# EAGLE design laser_shield (EAGLE 8.0.0)
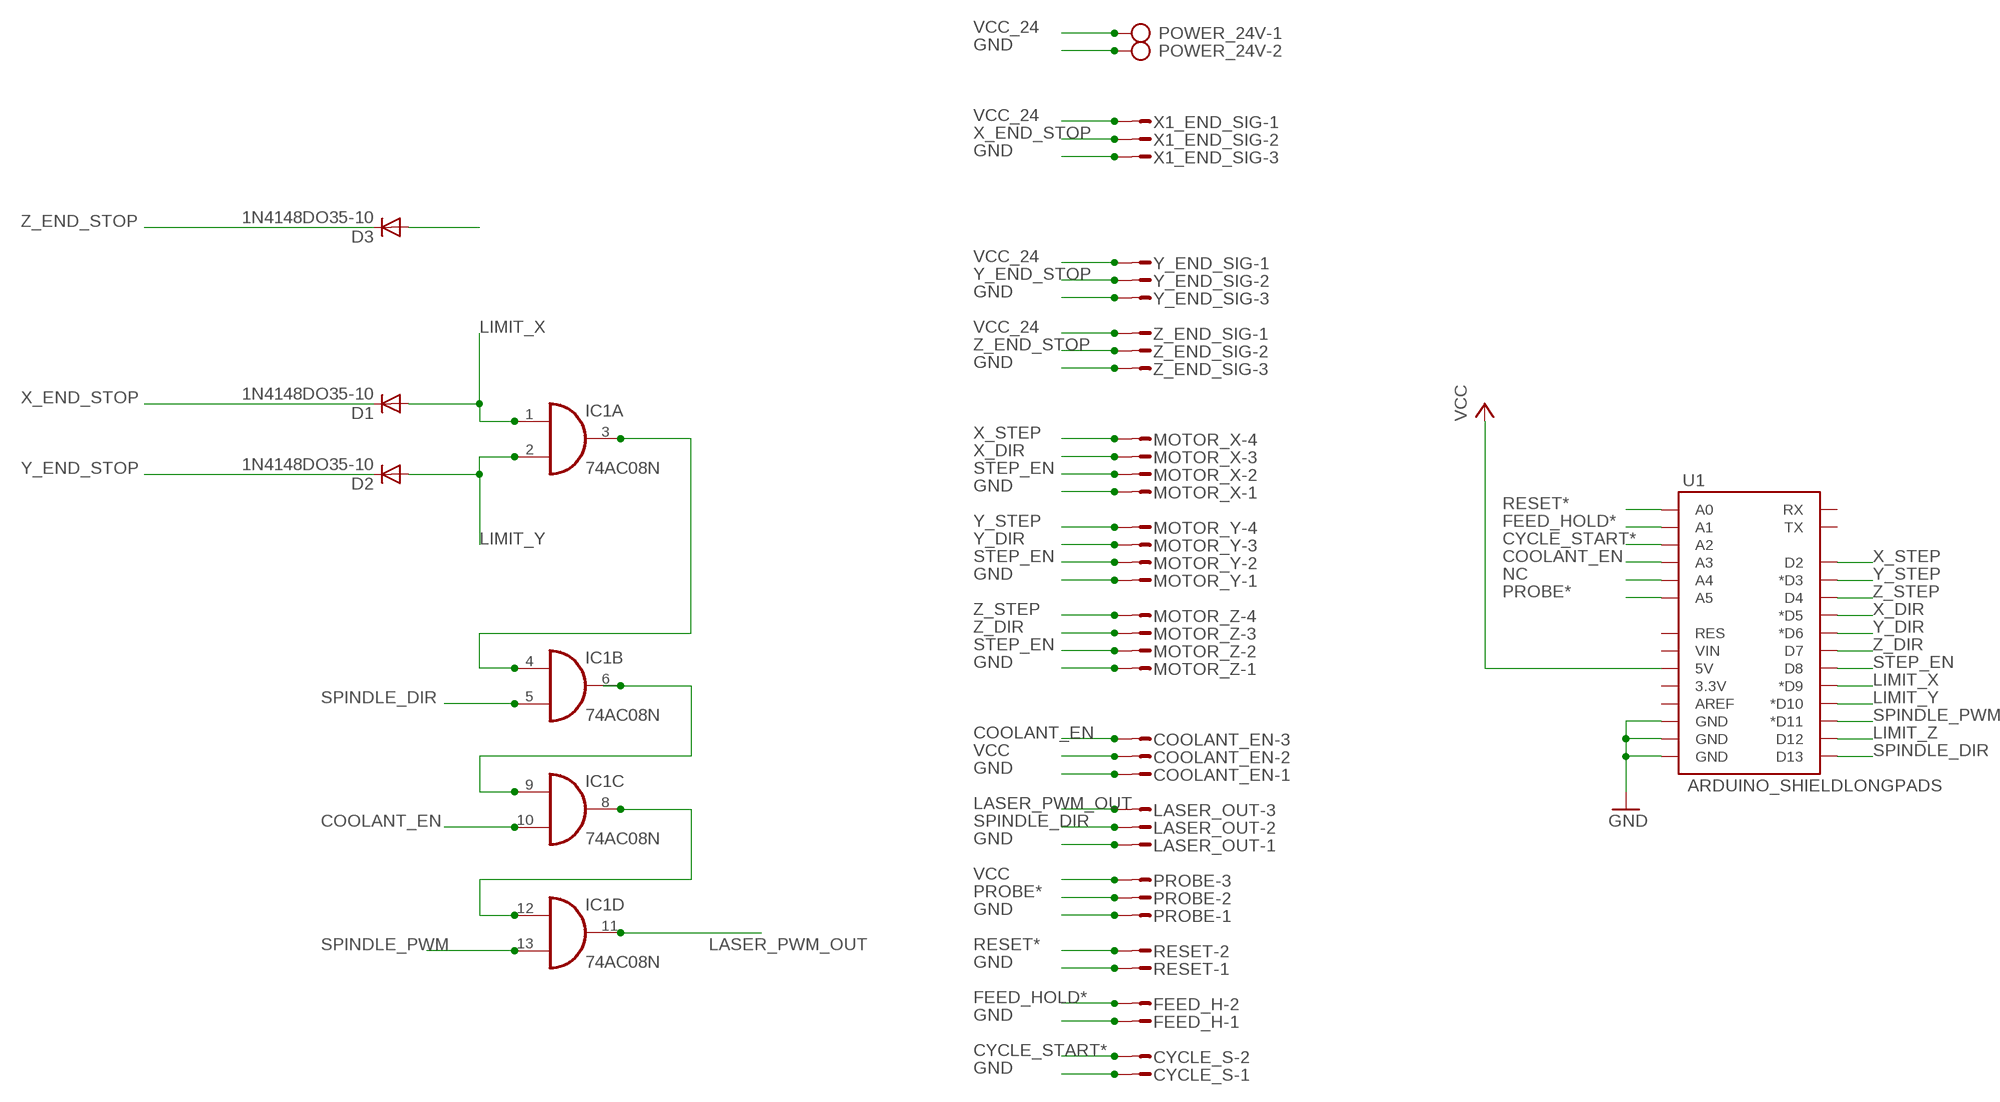
[diagram p0: schematic, sheet 1]

## Parts
COOLANT_EN  L03P  [L03P]
CYCLE_S  L02P  [L02P]
D1  1N4148DO35-10  [DO35-10]
D2  1N4148DO35-10  [DO35-10]
D3  1N4148DO35-10  [DO35-10]
FEED_H  L02P  [L02P]
IC1  74AC08N  [DIL14]
LASER_OUT  L03P  [L03P]
MOTOR_X  L04P  [L04P]
MOTOR_Y  L04P  [L04P]
MOTOR_Z  L04P  [L04P]
POWER_24V  AK300/2  [AK300/2]
PROBE  L03P  [L03P]
RESET  L02P  [L02P]
U1  ARDUINO_SHIELDLONGPADS  [DUEMILANOVE_SHIELD_LONGPADS]
X1_END_SIG  L03P  [L03P]
Y_END_SIG  L03P  [L03P]
Z_END_SIG  L03P  [L03P]

## Nets
COOLANT_EN: COOLANT_EN.3 IC1.10(C:I1) U1.A3
CYCLE_START*: CYCLE_S.2 U1.A2
FEED_HOLD*: FEED_H.2 U1.A1
GND [VCC_24]: COOLANT_EN.1 CYCLE_S.1 FEED_H.1 LASER_OUT.1 MOTOR_X.1 MOTOR_Y.1 MOTOR_Z.1 POWER_24V.2 PROBE.1 RESET.1 U1.GND@0(GND) U1.GND@1(GND) U1.GND@2(GND) X1_END_SIG.3 Y_END_SIG.3 Z_END_SIG.3
LASER_PWM_OUT: IC1.11(D:O) LASER_OUT.3
LIMIT_X: D1.A IC1.1(A:I0) U1.D9(*D9)
LIMIT_Y: D2.A IC1.2(A:I1) U1.D10(*D10)
LIMIT_Z: D3.A U1.D12
N$3: IC1.3(A:O) IC1.4(B:I0)
N$4: IC1.6(B:O) IC1.9(C:I0)
N$5: IC1.8(C:O) IC1.12(D:I0)
NC: U1.A4
PROBE*: PROBE.2 U1.A5
RESET*: RESET.2 U1.A0
SPINDLE_DIR: IC1.5(B:I1) LASER_OUT.2 U1.D13
SPINDLE_PWM: IC1.13(D:I1) U1.D11(*D11)
STEP_EN: MOTOR_X.2 MOTOR_Y.2 MOTOR_Z.2 U1.D8
VCC: COOLANT_EN.2 PROBE.3 U1.5V
VCC_24 [VCC_24]: POWER_24V.1 X1_END_SIG.1 Y_END_SIG.1 Z_END_SIG.1
X_DIR: MOTOR_X.3 U1.D5(*D5)
X_END_STOP: D1.C X1_END_SIG.2
X_STEP: MOTOR_X.4 U1.D2
Y_DIR: MOTOR_Y.3 U1.D6(*D6)
Y_END_STOP: D2.C Y_END_SIG.2
Y_STEP: MOTOR_Y.4 U1.D3(*D3)
Z_DIR: MOTOR_Z.3 U1.D7
Z_END_STOP: D3.C Z_END_SIG.2
Z_STEP: MOTOR_Z.4 U1.D4
Unconnected: U1.3.3V U1.AREF U1.RES U1.RX U1.TX U1.VIN

## Power pins joined to a net without a drawn wire
GND: IC1.7(P:GND)
VCC: IC1.14(P:VCC)

## Library data of the parts
COOLANT_EN LASER_OUT PROBE X1_END_SIG Y_END_SIG Z_END_SIG = con-amp-mt:L03P: AMP MT CONNECTOR; OC_FARNELL: unknown; OC_NEWARK: unknown
CYCLE_S FEED_H RESET = con-amp-mt:L02P: AMP MT CONNECTOR; OC_FARNELL: unknown; OC_NEWARK: unknown
D1-D3 = diode:1N4148: DIODE high speed (Philips)
IC1 = 74xx-eu:74*08: Quad 2-input AND gate
MOTOR_X MOTOR_Y MOTOR_Z = con-amp-mt:L04P: AMP MT CONNECTOR; OC_FARNELL: unknown; OC_NEWARK: unknown
POWER_24V = con-ptr500:AK300/2: CONNECTOR; OC_FARNELL: unknown; OC_NEWARK: unknown
U1 = SparkFun-Boards:ARDUINO_SHIELD: Arduino shield footprint

## Net classes
0 default: width 0.025 mm, drill 0.8 mm, clearance 0.025 mm
2 VCC_24: width 1 mm, drill 0.8 mm, clearance 0.025 mm

## Board
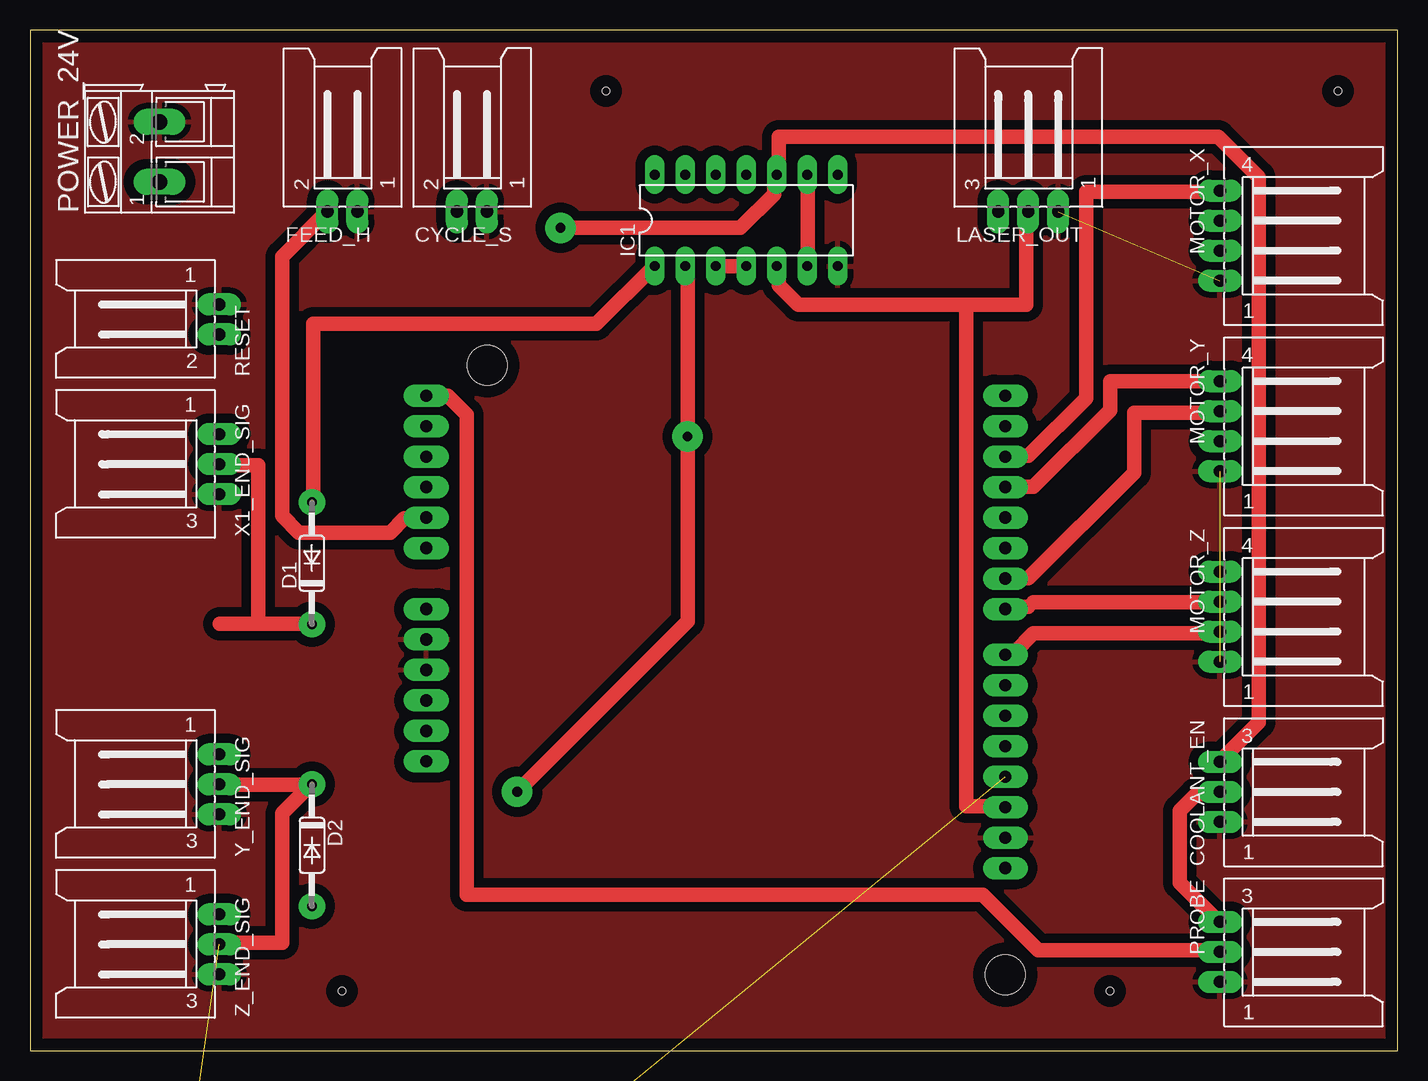
[diagram p1: board, top side]
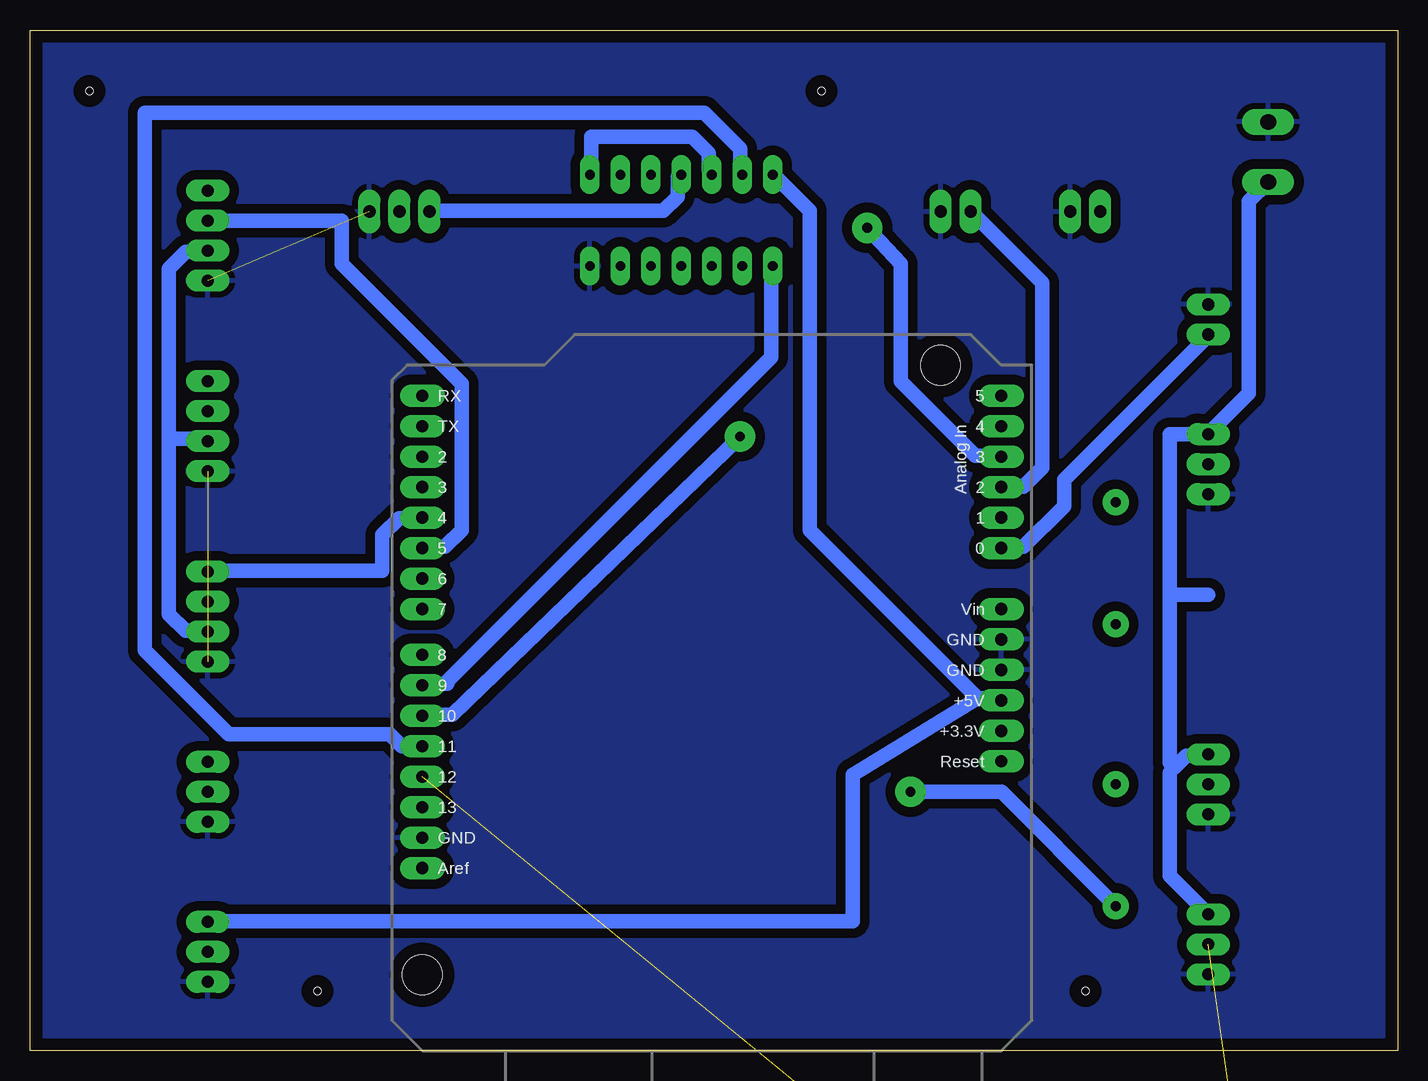
[diagram p2: board, bottom side, seen from below]

Size 113.97 x 85.08 mm. Coordinates in mm from the lower left corner, seen from the top.
Outline: 0,0 113.97,0 113.97,85.08 0,85.08 0,0
Copper layers (1*16): Top 0.035mm / dielectric 1.5mm / Bottom 0.035mm
Design rules "default *": minimum track width 1.2mm, minimum drill 0.8mm, track to track 0.8mm, track to pad 0.8mm, pad to pad 0.8mm, via to via 0.8mm, smd to smd 8mil, copper to edge 40mil, drill to drill 2.2mm, minimum pad ring 0.4mm, minimum via ring 0.4mm, stop-mask expansion 4mil, vias tented up to drill 0mil, thermal gap 0.5mm
Holes 0.6 mm at 26,5 90,5 109,80 48,80

### Footprints (pad centres in the part's own frame; a part is rotated, then mirrored left to right if it is on the bottom)
L03P = drill 1.016 long: 1 2.5,-6.25; 2 0,-6.25; 3 -2.5,-6.25
L02P = drill 1.016 long: 1 1.25,-6.25; 2 -1.25,-6.25
DO35-10 = drill 0.813 pad 2.184: A 5.08,0; C -5.08,0
DIL14 = drill 0.813 long: 1 -7.62,-3.81; 2 -5.08,-3.81; 3 -2.54,-3.81; 4 0,-3.81; 5 2.54,-3.81; 6 5.08,-3.81; 7 7.62,-3.81; 8 7.62,3.81; 9 5.08,3.81; 10 2.54,3.81; 11 0,3.81; 12 -2.54,3.81; 13 -5.08,3.81; 14 -7.62,3.81
L04P = drill 1.016 long: 1 3.75,-6.25; 2 1.25,-6.25; 3 -1.25,-6.25; 4 -3.75,-6.25
AK300/2 = drill 1.321 pad 2.184 long: 1 -2.515,0; 2 2.489,0
DUEMILANOVE_SHIELD_LONGPADS = drill 1.016 pad 1.88 long: 3.3V 50.8,26.67; 5V 50.8,29.21; A0 50.8,41.91; A1 50.8,44.45; A2 50.8,46.99; A3 50.8,49.53; A4 50.8,52.07; A5 50.8,54.61; AREF 2.54,15.24; D2 2.54,49.53; D3 2.54,46.99; D4 2.54,44.45; D5 2.54,41.91; D6 2.54,39.37; D7 2.54,36.83; D8 2.54,33.02; D9 2.54,30.48; D10 2.54,27.94; D11 2.54,25.4; D12 2.54,22.86; D13 2.54,20.32; GND@0 50.8,31.75; GND@1 50.8,34.29; GND@2 2.54,17.78; RES 50.8,24.13; RX 2.54,54.61; TX 2.54,52.07; VIN 50.8,36.83 | hole 3.302: 45.72,57.15; 2.54,6.35

### Placement (x,y rotation side)
COOLANT_EN  105.41,21.59 270 top
CYCLE_S  36.83,76.2 0 top
D1  23.5,40.64 90 top
D2  23.5,17.14 270 top
D3  15.8,-26.6 0 top  (outside the outline)
FEED_H  26.04,76.2 0 top
IC1  59.69,69.22 0 top
LASER_OUT  83.19,76.2 0 top
MOTOR_X  105.41,67.94 270 top
MOTOR_Y  105.41,52.07 270 top
MOTOR_Z  105.41,36.2 270 top
POWER_24V  10.79,74.93 90 top
PROBE  105.41,8.26 270 top
RESET  9.53,60.96 90 top
U1  83.82,0 0 bottom
X1_END_SIG  9.53,48.9 90 top
Y_END_SIG  9.53,22.23 90 top
Z_END_SIG  9.53,8.89 90 top

### Tracks (layer width: path | path; a pad name or v marks a point on that pad's centre or on a via)
COOLANT_EN  (via drill 0.8 pad 2.54)
  Top 1.2: v44.2,68.6 59.2,68.6 62,71.4 62,72.8 62.2,73 IC1.10 62.4,73.6 62.4,76.2 99,76.2 102.4,72.8 102.4,27.4 99.2,24.2 COOLANT_EN.3
  Bottom 1.2: v44.2,68.6 41.4,65.6 41.4,55.8 35.2,49.6 33.2,49.6 U1.A3
CYCLE_START*
  Bottom 1.2: CYCLE_S.2 35.4,69.8 29.6,64 29.6,48.6 31.2,47 33,47 U1.A2
FEED_HOLD*
  Top 1.2: FEED_H.2 24.6,69.8 21,66.2 21,44.6 22.4,43.2 30,43.2 31.2,44.4 33,44.4 U1.A1
GND  (2 unrouted)
  pour Bottom: 0,0 114.3,0 114.3,85.09 0,85.09
  pour Bottom: 0,0 114.3,0 114.3,85.09 0,85.09
  pour Top: 0,85.09 114.3,85.09 114.3,0 0,0
LASER_PWM_OUT
  Bottom 1.2: IC1.11 59.8,73 60,72.8 60,71.2 61.2,70 80.6,70 LASER_OUT.3
LIMIT_X
  Top 1.2: IC1.1 52,65.4 47.2,60.6 23.6,60.6 23.6,45.8 D1.A
  Bottom 1.2: U1.D9 81.2,30.6 79.2,30.6 79.2,30.8 52.2,57.8 52.2,65.4 IC1.1
LIMIT_Y  (via drill 0.8 pad 2.54)
  Top 1.2: IC1.2 54.8,65.4 v54.8,51.2 54.8,35.8 v40.6,21.6
  Bottom 1.2: v54.8,51.2 78.8,28 81.2,28 U1.D10 | v40.6,21.6 33,21.6 23.6,12.2 D2.A
LIMIT_Z  (1 unrouted)
N$3
  Top 1.2: IC1.3 57.2,65.4 59.6,65.4 IC1.4
N$4
  Top 1.2: IC1.6 64.8,65.6 64.8,73 IC1.9
N$5
  Bottom 1.2: IC1.12 57.2,73.2 57.4,73.4 57.4,74.8 58.8,76.2 67.2,76.2 67.2,73.2 IC1.8
PROBE*
  Top 1.2: PROBE.2 99,8.4 84,8.4 79.4,13 36.4,13 36.4,53 34.8,54.6 33.2,54.6 U1.A5
RESET*
  Bottom 1.2: RESET.2 15.8,59.6 27.8,47.6 27.8,45.4 31.2,42 33,42 U1.A0
SPINDLE_DIR
  Top 1.2: 78,62.2 83,62.2 83,69.8 LASER_OUT.2 | 78,62.2 64,62.2 62.4,63.8 62.4,65.4 IC1.5 | 78,62.2 78,20.4 81.2,20.4 U1.D13
SPINDLE_PWM
  Bottom 1.2: U1.D11 83,25.4 84,26.4 97.4,26.4 104.4,33.4 104.4,78.2 57.8,78.2 54.8,75.2 54.8,73.2 IC1.13
STEP_EN
  Top 1.2: MOTOR_Z.2 99,34.8 83.6,34.8 82,33.2 81.4,33.2 U1.D8
  Bottom 1.2: 102.4,51 99.2,51 MOTOR_Y.2 | 102.4,51 102.4,65.2 101,66.6 99.2,66.6 MOTOR_X.2 | 102.4,51 102.4,36.4 101,35 99.2,35 MOTOR_Z.2
VCC
  Top 1.2: PROBE.3 99,10.8 95.8,14 95.8,20 97.2,21.4 99,21.4 COOLANT_EN.2
  Bottom 1.2: 35,29.4 49,43.4 49,70 52,73 IC1.14 | 35,29.4 33.2,29.4 U1.5V | 35,29.4 45.4,23 45.4,10.8 99,10.8 PROBE.3
VCC_24
  Bottom 1.2: 18.6,23.6 17.6,24.6 15.8,24.6 Y_END_SIG.1 | 18.6,23.6 19,23.2 19,14.6 15.8,11.4 Z_END_SIG.1 | 19,38 15.8,38 | 19,38 19,24 18.6,23.6 | 19,38 19,51.4 15.8,51.4 X1_END_SIG.1 15.4,51.8 12.4,54.8 12.4,70.8 10.8,72.4 POWER_24V.1
X_DIR
  Bottom 1.2: MOTOR_X.3 99,69.2 88,69.2 88,65.6 78,55.6 78,43.4 79.4,42 81.2,42 U1.D5
X_END_STOP
  Top 1.2: 19,35.6 23.4,35.6 D1.C | 19,35.6 15.8,35.6 | 19,35.6 19,48.8 15.8,48.8 X1_END_SIG.2
X_STEP
  Top 1.2: MOTOR_X.4 99,71.6 88,71.6 88,54.4 83.2,49.6 81.4,49.6 U1.D2
Y_DIR
  Top 1.2: MOTOR_Y.3 99,53.2 92,53.2 92,48.2 83.2,39.4 81.4,39.4 U1.D6
Y_END_STOP
  Top 1.2: 15.8,9 21,9 21,19.8 23.4,22.2 D2.C 22.6,22.2 15.8,22.2 Y_END_SIG.2
Y_STEP
  Top 1.2: MOTOR_Y.4 99,55.8 90,55.8 90,53.4 83.6,47 81.4,47 U1.D3
Z_DIR
  Top 1.2: MOTOR_Z.3 99,37.4 83.6,37.4 83.2,37 81.4,37 U1.D7
Z_END_STOP  (1 unrouted)
Z_STEP
  Bottom 1.2: MOTOR_Z.4 99,40 84.6,40 84.6,43 83.2,44.4 81.4,44.4 U1.D4